# EAGLE design amp_msgeq7_v_1_0 (EAGLE 6.4)
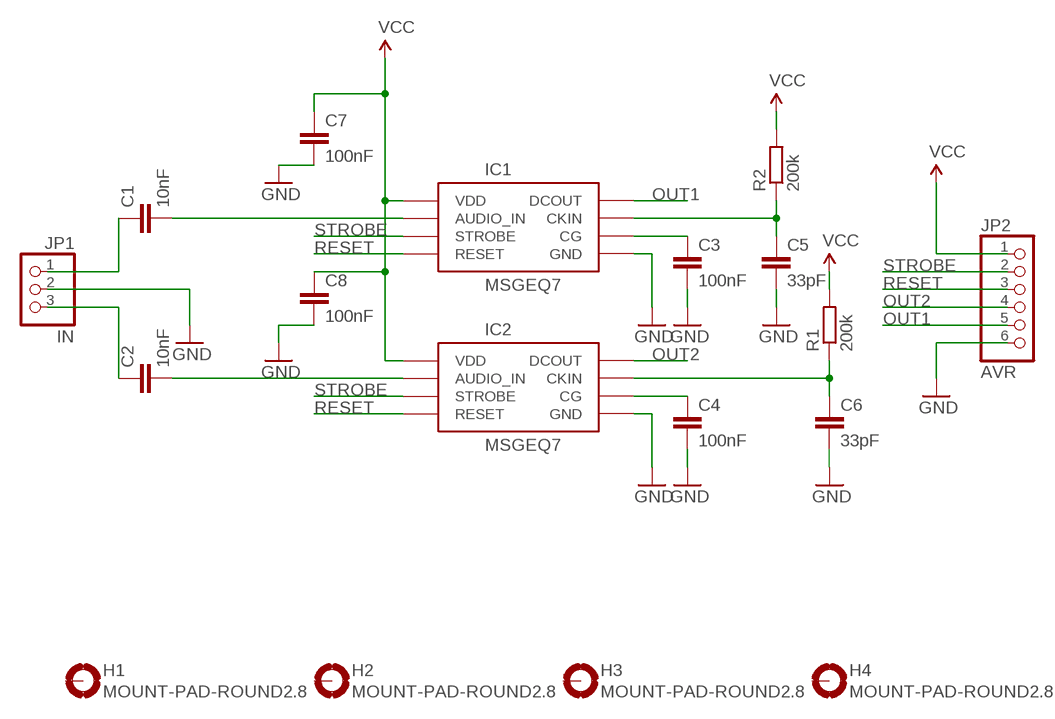
[diagram p0: schematic, sheet 1]

## Parts
C1  10nF  C-EU025-030X050  [C025-030X050]
C2  10nF  C-EU025-030X050  [C025-030X050]
C3  100nF  C-EU025-030X050  [C025-030X050]
C4  100nF  C-EU025-030X050  [C025-030X050]
C5  33pF  C-EU025-030X050  [C025-030X050]
C6  33pF  C-EU025-030X050  [C025-030X050]
C7  100nF  C-EU025-025X050  [C025-025X050]
C8  100nF  C-EU025-025X050  [C025-025X050]
H1  MOUNT-PAD-ROUND2.8  [2,8-PAD]
H2  MOUNT-PAD-ROUND2.8  [2,8-PAD]
H3  MOUNT-PAD-ROUND2.8  [2,8-PAD]
H4  MOUNT-PAD-ROUND2.8  [2,8-PAD]
IC1  MSGEQ7DIP  [DIL08]
IC2  MSGEQ7DIP  [DIL08]
JP1  IN  PINHD-1X3  [1X03]
JP2  AVR  PINHD-1X6  [1X06]
R1  200k  R-EU_0204/7  [0204/7]
R2  200k  R-EU_0204/7  [0204/7]

## Nets
GND: C3.2 C4.2 C5.2 C6.2 C7.2 C8.2 IC1.2(GND) IC2.2(GND) JP1.2 JP2.6
N$5: C1.1 JP1.1
N$6: C1.2 IC1.5(AUDIO_IN)
N$7: C2.1 JP1.3
N$8: C2.2 IC2.5(AUDIO_IN)
N$12: C3.1 IC1.6(CG)
N$14: C4.1 IC2.6(CG)
N$16: C5.1 IC1.8(CKIN) R2.1
N$17: C6.1 IC2.8(CKIN) R1.1
OUT1: IC1.3(DCOUT) JP2.5
OUT2: IC2.3(DCOUT) JP2.4
RESET: IC1.7(RESET) IC2.7(RESET) JP2.3
STROBE: IC1.4(STROBE) IC2.4(STROBE) JP2.2
VCC: C7.1 C8.1 IC1.1(VDD) IC2.1(VDD) JP2.1 R1.2 R2.2
Unconnected: H1.B2,8(MOUNT) H2.B2,8(MOUNT) H3.B2,8(MOUNT) H4.B2,8(MOUNT)

## Library data of the parts
C1-C8 = rcl:C-EU: CAPACITOR, European symbol
H1-H4 = holes:MOUNT-PAD-ROUND: MOUNTING PAD, round
IC1 IC2 = msgeq7:MSGEQ7: 7-band graphic equalizer
JP1 = pinhead:PINHD-1X3: PIN HEADER
JP2 = pinhead:PINHD-1X6: PIN HEADER
R1 R2 = rcl:R-EU_: RESISTOR, European symbol

## Board
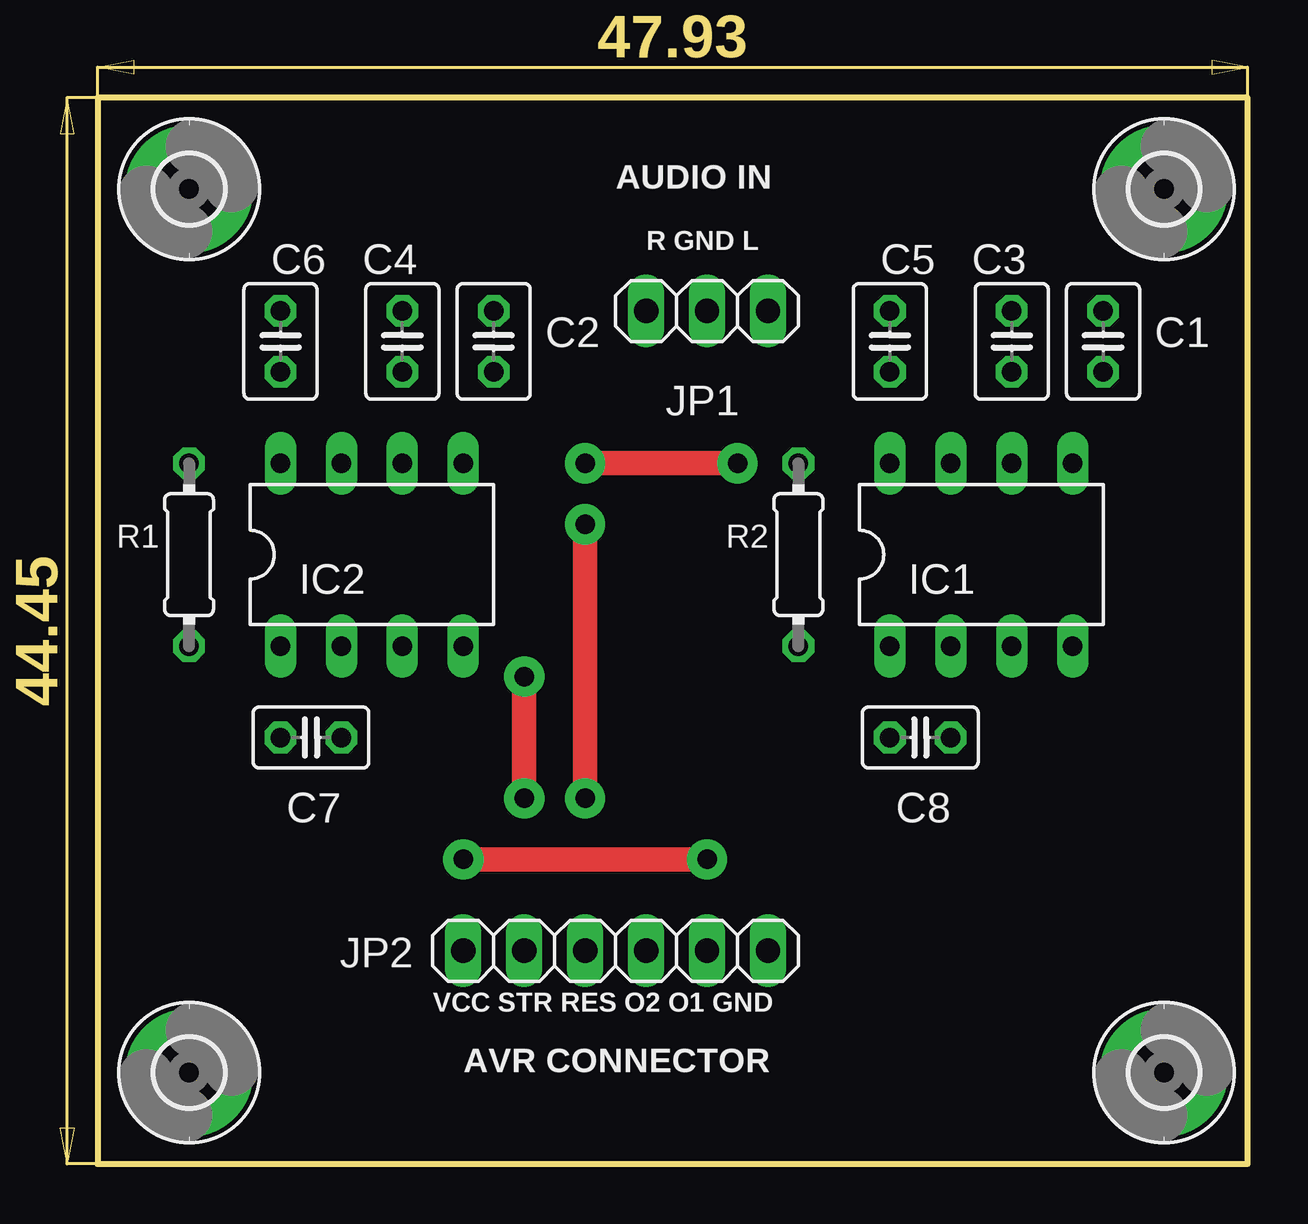
[diagram p1: board, top side]
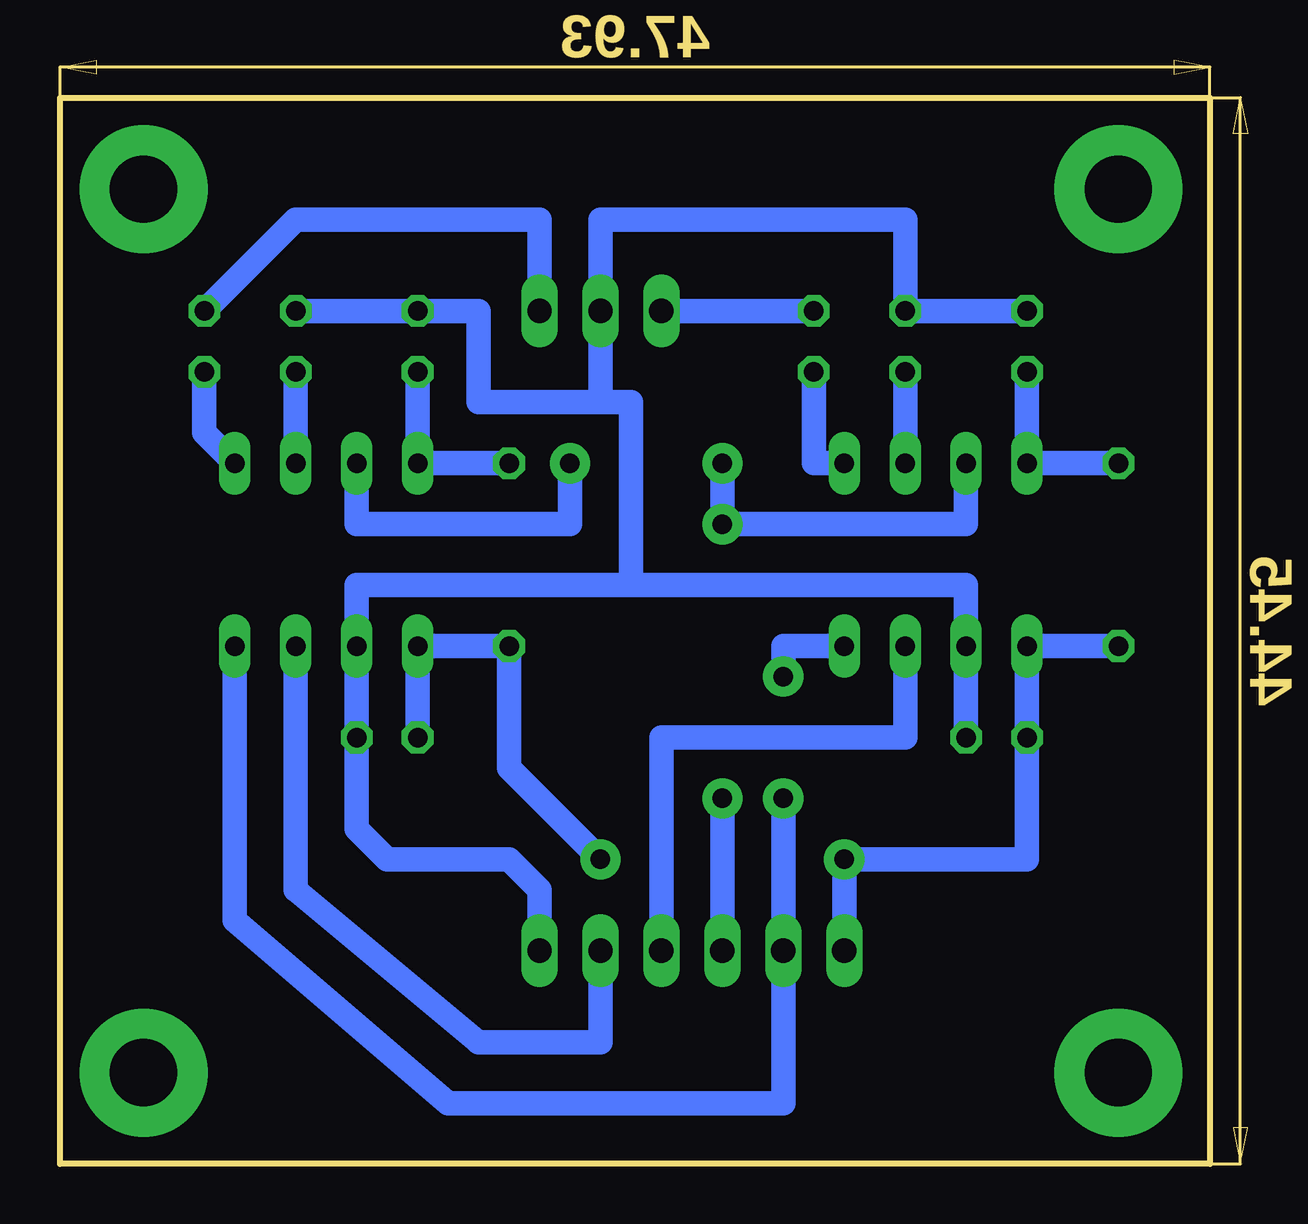
[diagram p2: board, bottom side, seen from below]

Size 47.93 x 44.44 mm. Coordinates in mm from the lower left corner, seen from the top.
Outline: 0,0 47.93,0 47.93,44.44 0,44.44 0,0
Copper layers (1*16): Top 0.035mm / dielectric 1.5mm / Bottom 0.035mm
Design rules "default": minimum track width 10mil, minimum drill 24mil, track to track 8mil, track to pad 8mil, pad to pad 8mil, via to via 8mil, smd to smd 8mil, copper to edge 40mil, drill to drill 8mil, minimum pad ring 10mil, minimum via ring 8mil, stop-mask expansion 4mil, vias tented up to drill 0mil, thermal gap 10mil

### Footprints (pad centres in the part's own frame; a part is rotated, then mirrored left to right if it is on the bottom)
C025-030X050 = drill 0.813 octagon: 1 -1.27,0; 2 1.27,0
C025-025X050 = drill 0.813 octagon: 1 -1.27,0; 2 1.27,0
2,8-PAD = drill 2.8 pad 5.334: B2,8 0,0
DIL08 = drill 0.813 long: 1 -3.81,-3.81; 2 -1.27,-3.81; 3 1.27,-3.81; 4 3.81,-3.81; 5 3.81,3.81; 6 1.27,3.81; 7 -1.27,3.81; 8 -3.81,3.81
1X03 = drill 1.016 long: 1 -2.54,0; 2 0,0; 3 2.54,0
1X06 = drill 1.016 long: 1 -6.35,0; 2 -3.81,0; 3 -1.27,0; 4 1.27,0; 5 3.81,0; 6 6.35,0
0204/7 = drill 0.813 octagon: 1 -3.81,0; 2 3.81,0

### Placement (x,y rotation side)
C1  41.91,34.29 270 top
C2  16.51,34.29 270 top
C3  38.1,34.29 90 top
C4  12.7,34.29 90 top
C5  33.02,34.29 90 top
C6  7.62,34.29 90 top
C7  8.89,17.78 0 top
C8  34.29,17.78 0 top
H1  3.81,40.64 0 top
H2  3.81,3.81 0 top
H3  44.45,3.81 0 top
H4  44.45,40.64 0 top
IC1  36.83,25.4 0 top
IC2  11.43,25.4 0 top
JP1  25.4,35.56 180 top
JP2  21.59,8.89 0 top
R1  3.81,25.4 270 top
R2  29.21,25.4 270 top

### Tracks (layer width: path | path; a pad name or v marks a point on that pad's centre or on a via)
GND
  Bottom 1.016: C6.2 C4.2 12.7,39.37 25.4,39.37 JP1.2 25.4,31.75 | C3.2 C5.2 30.48,35.56 30.48,31.75 25.4,31.75 | C7.2 IC2.2 10.16,24.13 24.13,24.13 | JP2.6 27.94,11.43 29.21,12.7 34.29,12.7 35.56,13.97 C8.2 IC1.2 35.56,24.13 24.13,24.13 | 24.13,24.13 24.13,31.75 25.4,31.75
N$5
  Bottom 1.016: JP1.1 27.94,39.37 38.1,39.37 C1.1
N$6
  Bottom 1.016: C1.2 41.91,30.48 IC1.5
N$7
  Bottom 1.016: JP1.3 C2.1
N$8
  Bottom 1.016: C2.2 16.51,29.21 IC2.5
N$12
  Bottom 1.016: C3.1 IC1.6
N$14
  Bottom 1.016: C4.1 IC2.6
N$16
  Bottom 1.016: C5.1 IC1.8 R2.1
N$17
  Bottom 1.016: C6.1 IC2.8 R1.1
OUT1
  Bottom 1.016: IC1.3 38.1,11.43 30.48,5.08 25.4,5.08 JP2.5
OUT2
  Bottom 1.016: IC2.3 12.7,17.78 22.86,17.78 JP2.4
RESET  (via drill 0.81 pad 1.68)
  Top 1.016: v20.32,29.21 v26.67,29.21 | v20.32,15.24 v20.32,26.67
  Bottom 1.016: IC2.7 10.16,26.67 v20.32,26.67 v20.32,29.21 | IC1.7 35.56,26.67 26.67,26.67 v26.67,29.21 | JP2.3 v20.32,15.24
STROBE  (via drill 0.81 pad 1.68)
  Top 1.016: v17.78,15.24 v17.78,20.32
  Bottom 1.016: IC1.4 40.64,10.16 31.75,2.54 17.78,2.54 JP2.2 v17.78,15.24 | v17.78,20.32 17.78,21.59 IC2.4
VCC  (via drill 0.81 pad 1.68)
  Top 1.016: v25.4,12.7 v15.24,12.7
  Bottom 1.016: R1.2 IC2.1 C7.1 7.62,12.7 v15.24,12.7 JP2.1 | C8.1 IC1.1 R2.2 29.21,16.51 v25.4,12.7

### Text on the board
tPlace: AUDIO IN | R GND L | VCC STR RES O2 O1 GND | AVR CONNECTOR